# Altium schematic sheet Audio input ADC.SchDoc
size A
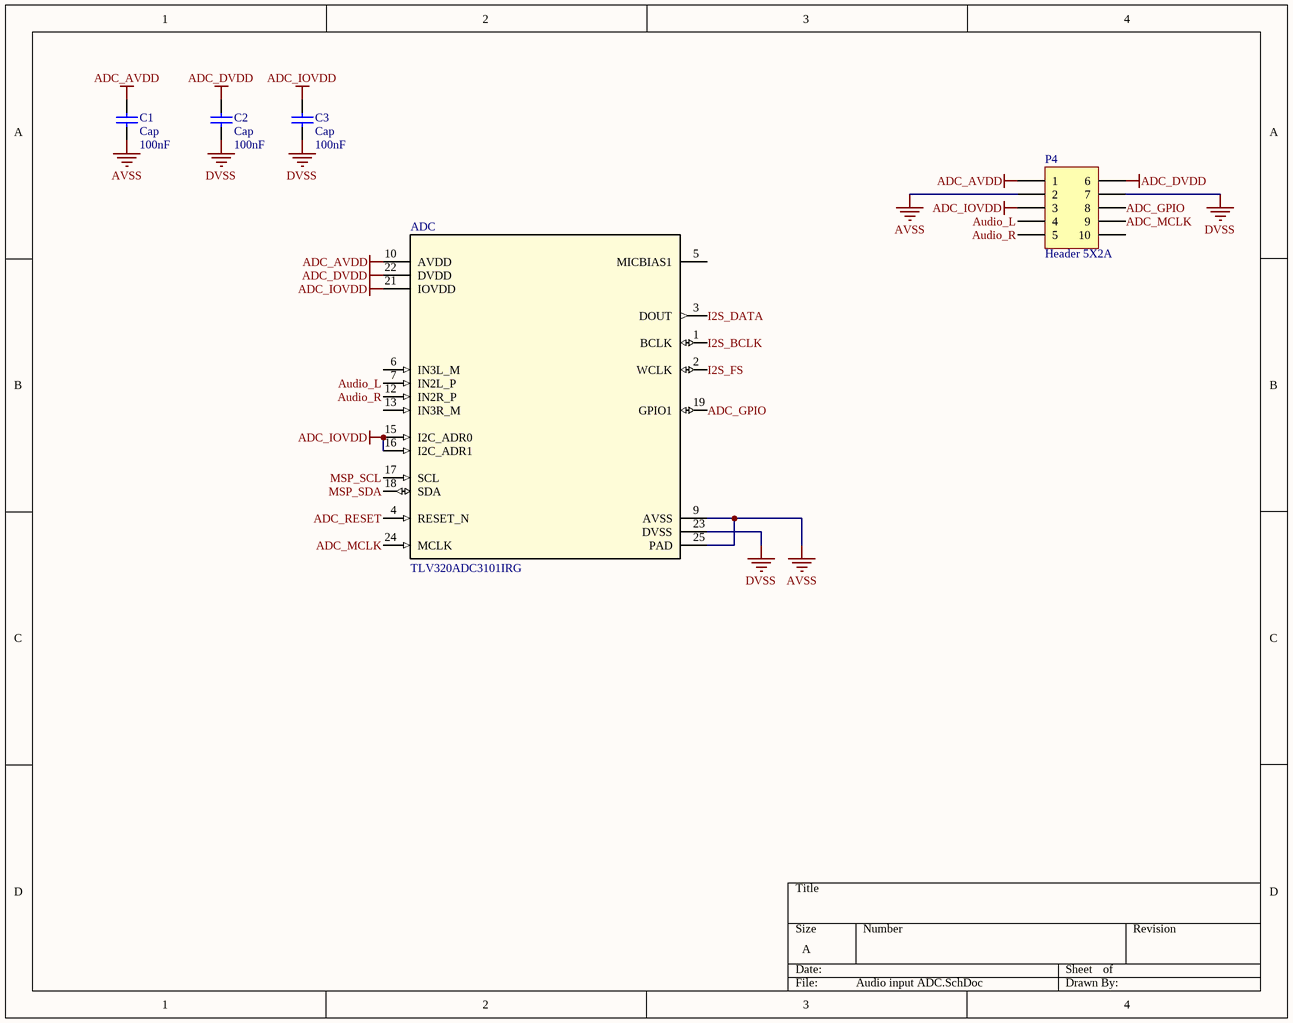
[diagram p0: Audio input ADC.SchDoc]

## Parts
ADC  TLV320ADC3101IRG  [RGE0024F_NV]
C1  Cap  value 100nF  [RAD-0.3]
C2  Cap  value 100nF  [RAD-0.3]
C3  Cap  value 100nF  [RAD-0.3]
P4  Header 5X2A  [HDR2X5_CEN]

## Nets
ADC_AVDD: ADC.10(AVDD) C1.2 P4.1
ADC_DVDD: ADC.22(DVDD) C2.2 P4.6
ADC_IOVDD: ADC.15(I2C_ADR0) ADC.16(I2C_ADR1) ADC.21(IOVDD) C3.2 P4.3
AVSS: ADC.9(AVSS) ADC.25(PAD) C1.1 P4.2
DVSS: ADC.23(DVSS) C2.1 C3.1 P4.7
ADC_GPIO: ADC.19(GPIO1) P4.8
ADC_MCLK: ADC.24(MCLK) P4.9
ADC_RESET: ADC.4(RESET_N)
Audio_L: ADC.7(IN2L_P) P4.4
Audio_R: ADC.12(IN2R_P) P4.5
I2S_BCLK: ADC.1(BCLK)
I2S_DATA: ADC.3(DOUT)
I2S_FS: ADC.2(WCLK)
MSP_SCL: ADC.17(SCL)
MSP_SDA: ADC.18(SDA)

Not connected (* = marked no-connect by the designer): ADC 5(MICBIAS1) 6(IN3L_M) 13(IN3R_M); P4 10

## Library data of the parts
ADC = TLV320ADC3101IRG: Imported; Manufacturer: Texas Instruments; PartNumber: TLV320ADC3101IRGER; RefDes: RefDes; TYPE: TYPE; Value: Value
C1-C3 = Cap: Capacitor; Published: 8-Jun-2000; LatestRevisionDate: 17-Jul-2002; LatestRevisionNote: Re-released for DXP Platform.; PackageReference: RAD-0.3; Publisher: Altium Limited; PackageDescription: Radial Cap, Thru-Hole; 2 Leads; 0.3 in Pin Spacing
P4 = Header 5X2A: Header, 5-Pin, Dual row; LatestRevisionDate: 17-Jul-2002; LatestRevisionNote: Re-released for DXP Platform.; Publisher: Altium Limited